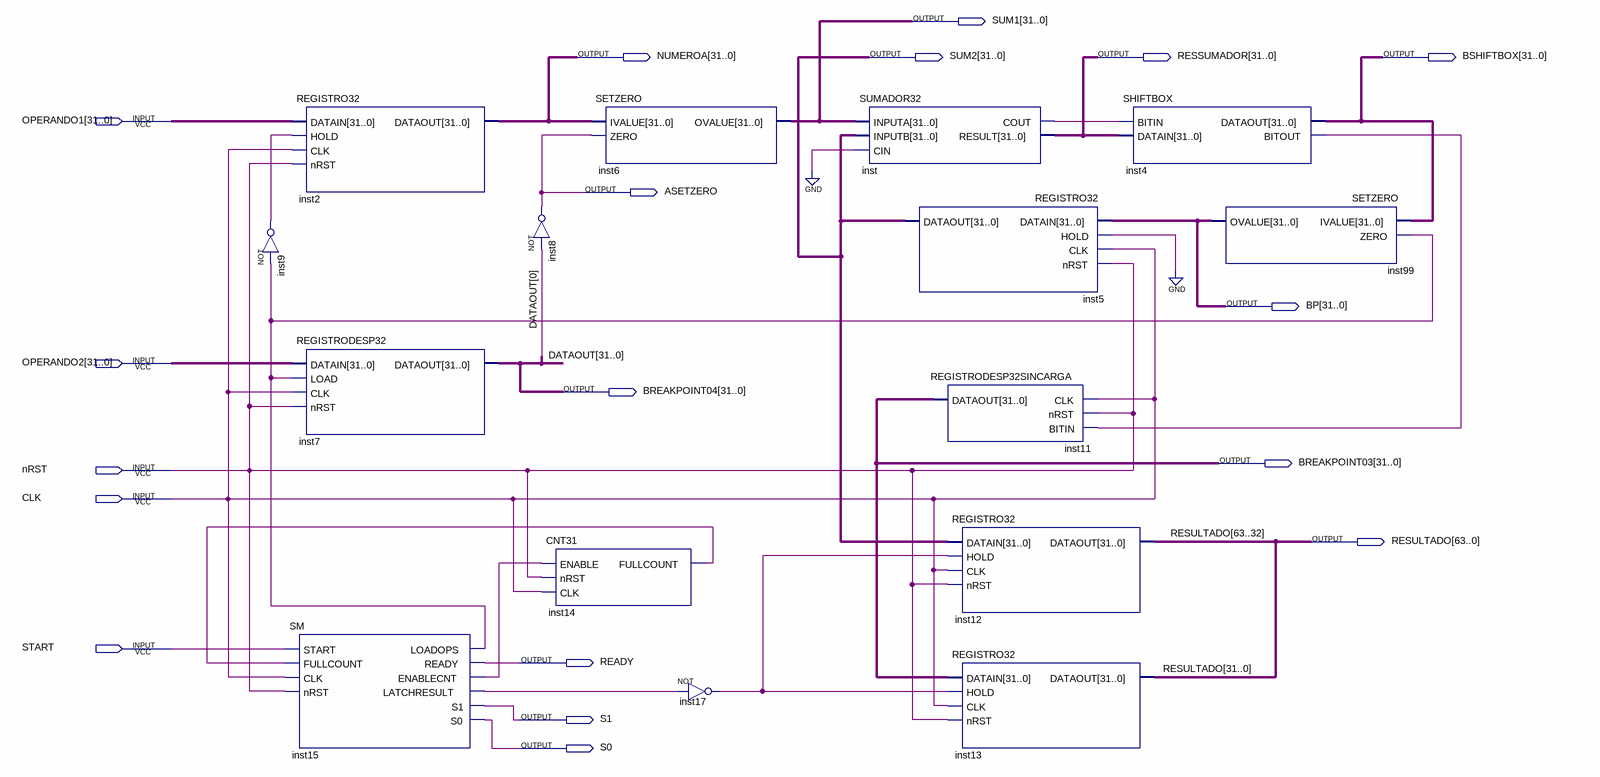
[diagram p0: schematic sheet]
// Quartus schematic TEST6.bdf as structural Verilog: 15 symbols, 18 pins
module TEST6 (
  input  [31:0] OPERANDO1,
  input  [31:0] OPERANDO2,
  input  nRST,
  input  CLK,
  input  START,
  output [31:0] SUM1,
  output [31:0] NUMEROA,
  output [31:0] SUM2,
  output [31:0] RESSUMADOR,
  output [31:0] BSHIFTBOX,
  output ASETZERO,
  output [31:0] BP,
  output [31:0] BREAKPOINT04,
  output [31:0] BREAKPOINT03,
  output [63:0] RESULTADO,
  output READY,
  output S1,
  output S0
);

  wire inst4_bitout, inst9_out, inst14_fullcount, inst15_enablecnt, inst15_latchresult, inst15_loadops,
       inst17_out, inst_cout;

  REGISTRO32 inst2 (.DATAIN(OPERANDO1), .HOLD(inst9_out), .CLK(CLK), .nRST(nRST), .DATAOUT(NUMEROA));
  not inst9 (inst9_out, inst15_loadops);
  REGISTRODESP32 inst7 (.DATAIN(OPERANDO2), .LOAD(inst15_loadops), .CLK(CLK), .nRST(nRST), .DATAOUT(BREAKPOINT04));
  SM inst15 (
    .START(START), .FULLCOUNT(inst14_fullcount), .CLK(CLK), .nRST(nRST), .LOADOPS(inst15_loadops),
    .READY(READY), .ENABLECNT(inst15_enablecnt), .LATCHRESULT(inst15_latchresult), .S1(S1), .S0(S0));
  not inst8 (ASETZERO, BREAKPOINT04[0]);
  SETZERO inst6 (.IVALUE(NUMEROA), .ZERO(ASETZERO), .OVALUE(SUM1));
  CNT31 inst14 (.ENABLE(inst15_enablecnt), .nRST(nRST), .CLK(CLK), .FULLCOUNT(inst14_fullcount));
  not inst17 (inst17_out, inst15_latchresult);
  SUMADOR32 inst (.INPUTA(SUM1), .INPUTB(SUM2), .CIN(1'b0), .COUT(inst_cout), .RESULT(RESSUMADOR));
  REGISTRO32 inst5 (.DATAIN(BP), .HOLD(1'b0), .CLK(CLK), .nRST(nRST), .DATAOUT(SUM2));
  REGISTRODESP32SINCARGA inst11 (.CLK(CLK), .nRST(nRST), .BITIN(inst4_bitout), .DATAOUT(BREAKPOINT03));
  REGISTRO32 inst12 (.DATAIN(SUM2), .HOLD(inst17_out), .CLK(CLK), .nRST(nRST), .DATAOUT(RESULTADO[63:32]));
  REGISTRO32 inst13 (.DATAIN(BREAKPOINT03), .HOLD(inst17_out), .CLK(CLK), .nRST(nRST), .DATAOUT(RESULTADO[31:0]));
  SHIFTBOX inst4 (.BITIN(inst_cout), .DATAIN(RESSUMADOR), .DATAOUT(BSHIFTBOX), .BITOUT(inst4_bitout));
  SETZERO inst99 (.IVALUE(BSHIFTBOX), .ZERO(inst15_loadops), .OVALUE(BP));

  // Other names for the same wires on the sheet: DATAOUT[31:0] = BREAKPOINT04
endmodule
